# Altium schematic sheet Media.SchDoc
size A; SheetNumber: 4; SheetTotal: 5
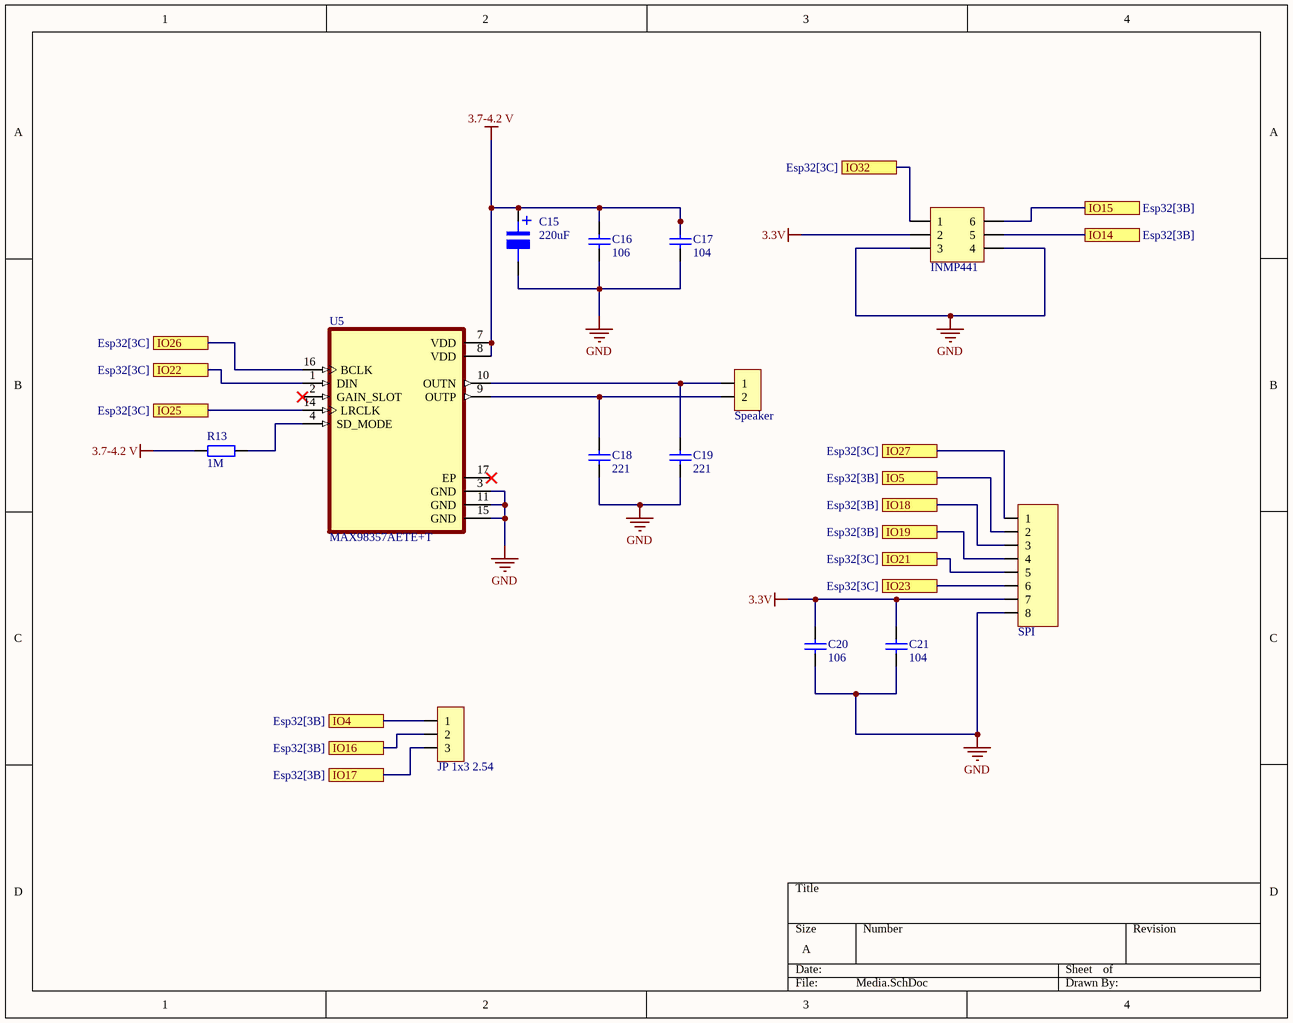
[diagram p0: Media.SchDoc]

## Parts
C15  220uF  [tu nhom 8 (e)]
C16  106  [tu 0805]
C17  104  [tu 0805]
C18  221  [tu 0805]
C19  221  [tu 0805]
C20  106  [tu 0805]
C21  104  [tu 0805]
GND_speaker  INMP441  [JP 2x3 DT]
JP7  JP 1x3 2.54  [JP 1x3 DT]
N_P  Speaker  [JP 1x2 DT]
R13  1M  [tro smd 0805]
SPI_3.3V_GND  SPI  [JP 1x8 DT]
U5  MAX98357AETE+T  [QFN50P300X300X80-17N]

## Ports
IO4 (see Esp32[3B]), IO5 (see Esp32[3B]), IO14 (see Esp32[3B]), IO15 (see Esp32[3B]), IO16 (see Esp32[3B]), IO17 (see Esp32[3B]), IO18 (see Esp32[3B]), IO19 (see Esp32[3B]), IO21 (see Esp32[3C]), IO22 (see Esp32[3C]), IO23 (see Esp32[3C]), IO25 (see Esp32[3C]), IO26 (see Esp32[3C]), IO27 (see Esp32[3C]), IO32 (see Esp32[3C])

## Nets
3.3V: C20.1 C21.1 GND_speaker.2 SPI_3.3V_GND.7
3.7-4.2 V: C15.1 C16.1 C17.1 R13.1 U5.7(VDD) U5.8(VDD)
GND: C15.2 C16.2 C17.2 C18.2 C19.2 C20.2 C21.2 GND_speaker.3 GND_speaker.4 SPI_3.3V_GND.8 U5.3(GND) U5.11(GND) U5.15(GND)
IO4: JP7.1 ; port IO4
IO5: SPI_3.3V_GND.2 ; port IO5
IO14: GND_speaker.5 ; port IO14
IO15: GND_speaker.6 ; port IO15
IO16: JP7.2 ; port IO16
IO17: JP7.3 ; port IO17
IO18: SPI_3.3V_GND.3 ; port IO18
IO19: SPI_3.3V_GND.4 ; port IO19
IO21: SPI_3.3V_GND.5 ; port IO21
IO22: U5.1(DIN) ; port IO22
IO23: SPI_3.3V_GND.6 ; port IO23
IO25: U5.14(LRCLK) ; port IO25
IO26: U5.16(BCLK) ; port IO26
IO27: SPI_3.3V_GND.1 ; port IO27
IO32: GND_speaker.1 ; port IO32
NetC18_1: C18.1 N_P.2 U5.9(OUTP)
NetC19_1: C19.1 N_P.1 U5.10(OUTN)
NetR13_2: R13.2 U5.4(SD_MODE)

Not connected (* = marked no-connect by the designer): U5 2(GAIN_SLOT)* 17(EP)*

## Notes on the sheet
- (in symbol Tu Nhom 220uF 10V) +

## Library data of the parts
C15 = Tu Nhom 220uF 10V: Dán; So_Chan: 2; Ten_Linh_Kien: Tụ Nhôm 220uF 10V; Ma_Hang: MH004021; Don_Vi: Con; Chung_Loai: Dán; Kieu_Chan: *
C16 C20 C21 = Tu 0805 106 16V 10%: Dán; Ten_Linh_Kien: Tụ 0805 106-10uF 10% 16V; So_Chan: 2; Don_Vi: Con; Ma_Hang: MH004553; Chung_Loai: Dán; Kieu_Chan: *
C17 = Tu 0805 104 50V 10%: Dán; Don_Vi: Con; So_Chan: 2; Ten_Linh_Kien: Tụ 0805 104-100nF 10% 50V; Ma_Hang: MH004551; Chung_Loai: Dán; Kieu_Chan: *
C18 C19 = Tu 0805 221 50V: Dán; Don_Vi: Con; So_Chan: 2; Ten_Linh_Kien: Tụ 0805 221-220P 50V; Ma_Hang: MH007365; Chung_Loai: Dán; Kieu_Chan: *
GND_speaker = JP 2x3 2.54 Duc Thang: Cắm; Ten_Linh_Kien: Jump Đôi Đực 2.54MM 2x40P Thẳng 11MM; Don_Vi: Con; Ma_Hang: MH002686; Ghi_Chu: *; Kieu_Chan: *; Chung_Loai: Cắm
JP7 = JP 1x3 2.54 Duc Thang: Cắm; Ten_Linh_Kien: Jump Đơn Đực 2.54MM 1x40P Thẳng 11MM; Don_Vi: Con; Ma_Hang: MH000903; Ghi_Chu: *; Kieu_Chan: *; Chung_Loai: Cắm
N_P = JP 1x2 2.54 Duc Thang: Cắm; Ten_Linh_Kien: Jump Đơn Đực 2.54MM 1x40P Thẳng 11MM; Don_Vi: Con; Ma_Hang: MH000903; Ghi_Chu: *; Kieu_Chan: *; Chung_Loai: Cắm
R13 = Tro 0805 5% 1M: Dán; Don_Vi: Con; So_Chan: 2; Ten_Linh_Kien: Trở 0805 5% 1M; Ma_Hang: MH005235; Chung_Loai: Dán; Kieu_Chan: *
SPI_3.3V_GND = JP 1x8 2.54 Duc Thang: Cắm; Ten_Linh_Kien: Jump Đơn Đực 2.54MM 1x40P Thẳng 11MM; Don_Vi: Con; Ma_Hang: MH000903; Ghi_Chu: *; Kieu_Chan: *; Chung_Loai: Cắm
U5 = MAX98357AETE+T: Tiny, Low-Cost, PCM Class D Amplifier with Class AB Performance; MF: Analog Devices; SnapEDA_Link: https://www.snapeda.com/parts/MAX98357AETE+T/Analog+Devices/view-part/?ref=snap; Package: TQFN-16 Maxim; Value: *; MP: MAX98357AETE+T; Check_prices: https://www.snapeda.com/parts/MAX98357AETE+T/Analog+Devices/view-part/?ref=eda